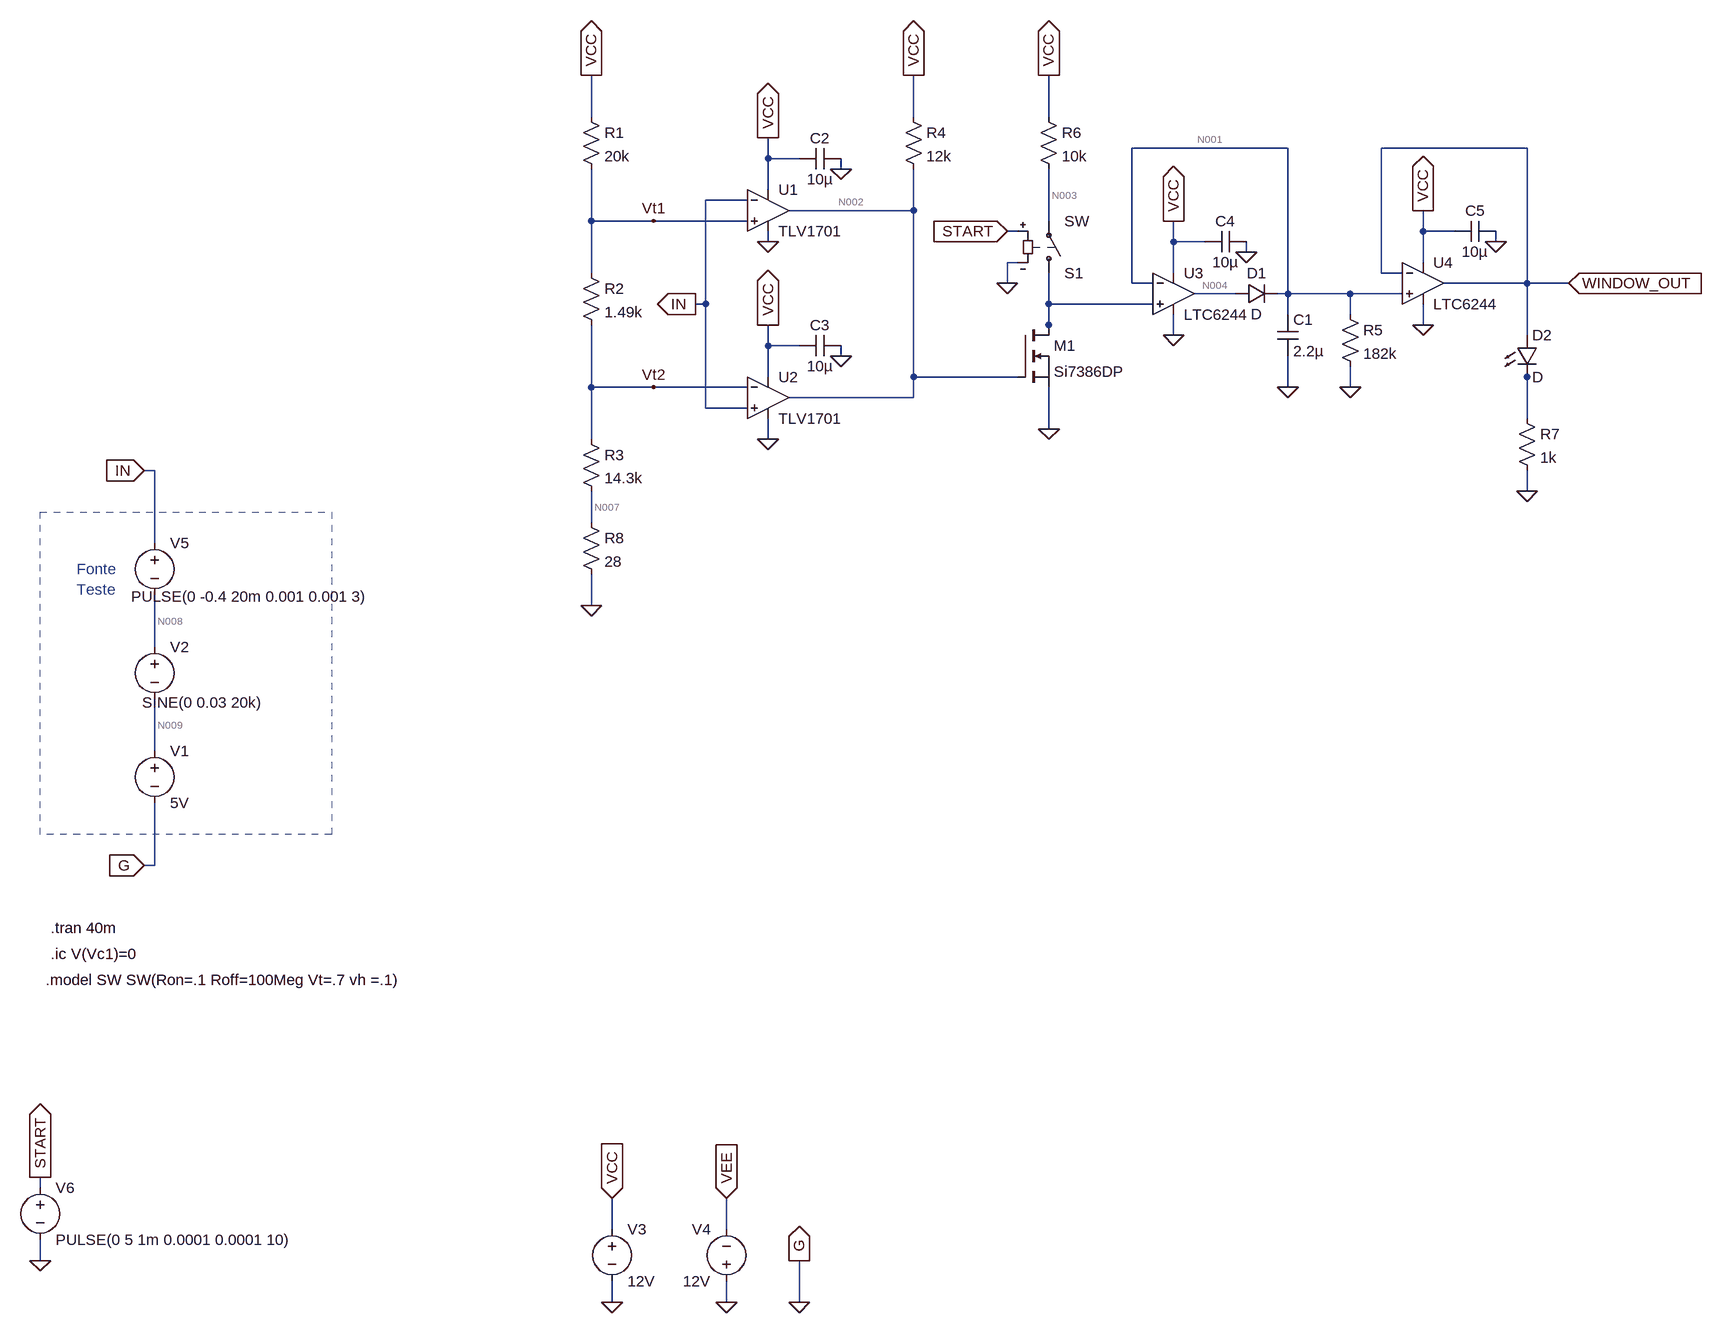
[diagram p0: schematic Janela.asc]
* Janela.asc
V3 VCC 0 12V
V4 0 VEE 12V
V1 N009 0 5V
V2 N008 N009 SINE(0 0.03 20k)
V5 IN N008 PULSE(0 -0.4 20m 0.001 0.001 3)
R1 VCC Vt1 20k
R2 Vt1 Vt2 1.49k
R3 Vt2 N007 14.3k
* U1: TLV1701 (symbol AutoGenerated\TLV1701 not available, pins judged from their places): In+=Vt1 In-=IN V+=VCC V-=0 OUT=N002
* U2: TLV1701 (symbol AutoGenerated\TLV1701 not available, pins judged from their places): In+=IN In-=Vt2 V+=VCC V-=0 OUT=N002
R4 VCC N002 12k
XU3 N005 N001 VCC 0 N004 LTC6244  ; pins In+ In- V+ V- OUT
D1 N004 N001 D
C1 N001 0 2.2µ
R5 N001 0 182k
XU4 N001 WINDOW_OUT VCC 0 WINDOW_OUT LTC6244  ; pins In+ In- V+ V- OUT
M1 N005 N002 0 0 Si7386DP
R6 VCC N003 10k
D2 WINDOW_OUT N006 D
R7 N006 0 1k
C2 0 VCC 10µ
C3 0 VCC 10µ
C4 0 VCC 10µ
C5 0 VCC 10µ
S1 N005 N003 START 0 SW
V6 START 0 PULSE(0 5 1m 0.0001 0.0001 10)
R8 N007 0 28
.model D D
.lib standard.dio
.model NMOS NMOS
.model PMOS PMOS
.lib standard.mos
* Fonte
* Teste
.tran 40m
.model SW SW(Ron=.1 Roff=100Meg Vt=.7 vh =.1)
.ic V(Vc1)=0
.backanno
.end

* Results of the author's LTspice run, read from the files saved beside the schematic
* Operating Point, zero values left out:
*   V(vcc) = 12 V
*   V(vee) = -12 V
*   V(n009) = 5 V
*   V(n008) = 5 V
*   V(in) = 5 V
*   V(vt1) = 5.299 V
*   V(vt2) = 4.8 V
*   V(n007) = 9.381 mV
*   V(n002) = 12 V
*   V(n001) = 640 µV
*   V(n004) = 330.9 mV
*   V(window_out) = 1.271 mV
*   V(n003) = 12 V
*   Id(M1) = 120 nA
*   Is(M1) = -120 nA
*   I(D1) = 3.517 nA
*   I(R8) = 335 µA
*   I(R6) = 120 nA
*   I(R5) = 3.517 nA
*   I(R4) = 76.2 pA
*   I(R3) = 335 µA
*   I(R2) = 335 µA
*   I(R1) = 335 µA
*   I(S1) = 120 nA
*   I(V5) = -10 nA
*   I(V2) = -10 nA
*   I(V1) = -10 nA
*   I(V3) = -4.248 mA
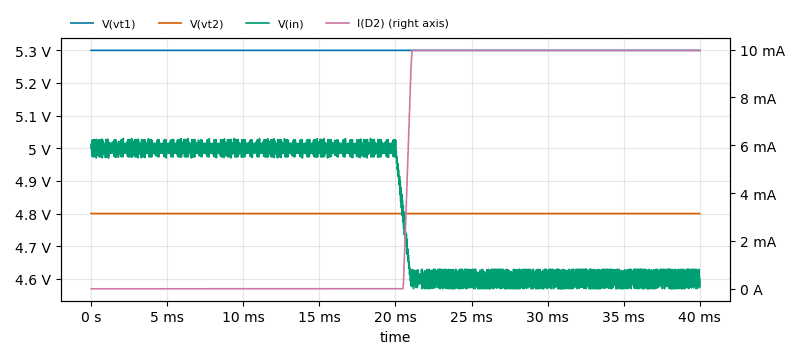
[diagram p1: Transient Analysis of Janela.asc, plotted from the saved traces]
* Transient Analysis, 1 run:
*   V(vt1): min 5.299 V, max 5.299 V, average 5.299 V, rms 5.299 V, last 5.299 V
*   V(vt2): min 4.8 V, max 4.8 V, average 4.8 V, rms 4.8 V, last 4.8 V
*   V(in): min 4.57 V, max 5.03 V, average 4.805 V, rms 4.809 V, last 4.6 V
*   I(D2): min 0 A, max 9.968 mA, average 4.784 mA, rms 6.887 mA, last 9.963 mA